# Altium project DronePCB.PrjPcb
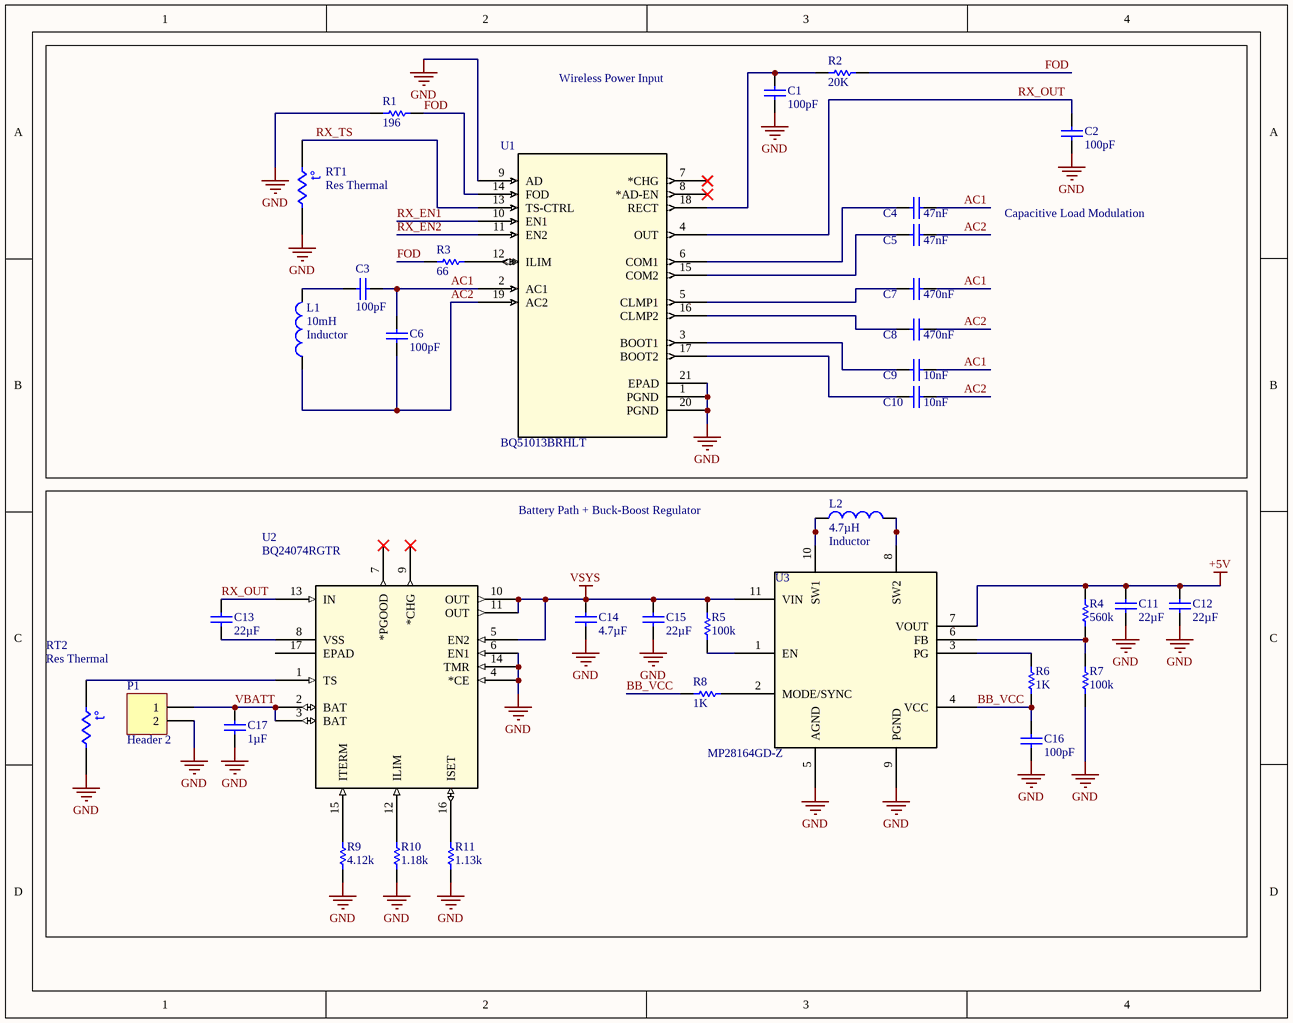
[diagram p0: DronePCB_1.SchDoc]
2 sheets, 58 parts. Net scope: global (net labels, ports and power ports of the same name join across sheets).
Sheets:
  DronePCB_1.SchDoc
  DronePCB_2.SchDoc

## Sheet DronePCB_1.SchDoc
size A; SheetNumber: 1; SheetTotal: 2

### Parts
C1  value 100pF  [RAD-0.3]  (hidden comment: Cap)
C2  value 100pF  [RAD-0.3]  (hidden comment: Cap)
C3  value 100pF  [RAD-0.3]  (hidden comment: Cap)
C4  value 47nF  [RAD-0.3]  (hidden comment: Cap)
C5  value 47nF  [RAD-0.3]  (hidden comment: Cap)
C6  value 100pF  [RAD-0.3]  (hidden comment: Cap)
C7  value 470nF  [RAD-0.3]  (hidden comment: Cap)
C8  value 470nF  [RAD-0.3]  (hidden comment: Cap)
C9  value 10nF  [RAD-0.3]  (hidden comment: Cap)
C10  value 10nF  [RAD-0.3]  (hidden comment: Cap)
C11  value 22µF  [RAD-0.3]  (hidden comment: Cap)
C12  value 22µF  [RAD-0.3]  (hidden comment: Cap)
C13  value 22µF  [RAD-0.3]  (hidden comment: Cap)
C14  value 4.7µF  [RAD-0.3]  (hidden comment: Cap)
C15  value 22µF  [RAD-0.3]  (hidden comment: Cap)
C16  value 100pF  [RAD-0.3]  (hidden comment: Cap)
C17  value 1µF  [RAD-0.3]  (hidden comment: Cap)
L1  Inductor  value 10mH  [0402-A]
L2  Inductor  value 4.7µH  [0402-A]
P1  Header 2  [CUI_TB002-500-02BE]
R1  value 196  [AXIAL-0.3]  (hidden comment: Res1)
R2  value 20K  [AXIAL-0.3]  (hidden comment: Res1)
R3  value 66  [AXIAL-0.3]  (hidden comment: Res1)
R4  value 560k  [AXIAL-0.3]  (hidden comment: Res1)
R5  value 100k  [AXIAL-0.3]  (hidden comment: Res1)
R6  value 1K  [AXIAL-0.3]  (hidden comment: Res1)
R7  value 100k  [AXIAL-0.3]  (hidden comment: Res1)
R8  value 1K  [AXIAL-0.3]  (hidden comment: Res1)
R9  value 4.12k  [AXIAL-0.3]  (hidden comment: Res1)
R10  value 1.18k  [AXIAL-0.3]  (hidden comment: Res1)
R11  value 1.13k  [AXIAL-0.3]  (hidden comment: Res1)
RT1  Res Thermal  [6-0805_N]
RT2  Res Thermal  [6-0805_N]
U1  BQ51013BRHLT  [RHL20_2P05X3P05]
U2  BQ24074RGTR  [RGT16_1P7X1P7]
U3  MP28164GD-Z  [QFN-11_MP28164_MNP]

### Blocks framed on the sheet
Battery Path + Buck-Boost Regulator: C11-C17 L2 P1 R4-R11 RT2 U2 U3

### Nets
+5V: C11.2 C12.2 R4.2 U3.7(VOUT)
GND: C1.2 C2.2 C11.1 C12.1 C14.1 C15.1 C16.1 C17.1 P1.2 R1.1 R7.1 R9.1 R10.1 R11.1 RT1.2 RT2.2 U1.1(PGND) U1.9(AD) U1.20(PGND) U1.21(EPAD) U2.4(*CE) U2.6(EN1) U2.14(TMR) U3.5(AGND) U3.9(PGND)
VBATT: C17.2 P1.1 U2.2(BAT) U2.3(BAT)
VSYS: C14.2 C15.2 R5.1 U2.5(EN2) U2.10(OUT) U2.11(OUT) U3.11(VIN)
AC1: C3.2 C4.2 C6.2 C7.2 C9.2 U1.2(AC1)
AC2: C5.2 C6.1 C8.2 C10.2 L1.1 U1.19(AC2)
BB_VCC: C16.2 R6.1 R8.2 U3.4(VCC)
FOD: R1.2 R2.2 R3.1 U1.14(FOD)
RX_EN1: U1.10(EN1)
RX_EN2: U1.11(EN2)
RX_OUT: C2.1 C13.2 U1.4(OUT) U2.13(IN)
RX_TS: RT1.1 U1.13(TS-CTRL)
NetC1_1: C1.1 R2.1 U1.18(RECT)
NetC3_1: C3.1 L1.2
NetC4_1: C4.1 U1.6(COM1)
NetC5_1: C5.1 U1.15(COM2)
NetC7_1: C7.1 U1.5(CLMP1)
NetC8_1: C8.1 U1.16(CLMP2)
NetC9_1: C9.1 U1.3(BOOT1)
NetC10_1: C10.1 U1.17(BOOT2)
NetC13_1: C13.1 U2.8(VSS)
NetL2_1: L2.1 U3.10(SW1)
NetL2_2: L2.2 U3.8(SW2)
NetR3_2: R3.2 U1.12(ILIM)
NetR4_1: R4.1 R7.2 U3.6(FB)
NetR5_2: R5.2 U3.1(EN)
NetR6_2: R6.2 U3.3(PG)
NetR8_1: R8.1 U3.2(MODE/SYNC)
NetR9_2: R9.2 U2.15(ITERM)
NetR10_2: R10.2 U2.12(ILIM)
NetR11_2: R11.2 U2.16(ISET)
NetRT2_1: RT2.1 U2.1(TS)

Not connected (* = marked no-connect by the designer): U1 7(*CHG)* 8(*AD-EN)*; U2 7(*PGOOD)* 9(*CHG)* 17(EPAD)

### Notes on the sheet
- Wireless Power Input
- Capacitive Load Modulation
- (in symbol Res Thermal) t°

### Library data of the parts
C1-C17 = Cap: Capacitor; Published: 8-Jun-2000; LatestRevisionDate: 17-Jul-2002; LatestRevisionNote: Re-released for DXP Platform.; PackageReference: RAD-0.3; Publisher: Altium Limited; PackageDescription: Radial Cap, Thru-Hole; 2 Leads; 0.3 in Pin Spacing
L1 L2 = Inductor: Code_IEC: 1005; Published: 8-Jun-2000; LatestRevisionDate: 29-May-2009; LatestRevisionNote: IPC-7351 Footprint Added.; PackageReference: 0402-A; Publisher: Altium Limited; PackageDescription: Chip Inductor; Code_JEITA: 0402
P1 = Header 2: Header, 2-Pin; LatestRevisionDate: 17-Jul-2002; LatestRevisionNote: Re-released for DXP Platform.; Publisher: Altium Limited
R1-R11 = Res1: Resistor; Published: 8-Jun-2000; LatestRevisionDate: 17-Jul-2002; LatestRevisionNote: Re-released for DXP Platform.; PackageReference: AXIAL-0.3; Publisher: Altium Limited; PackageDescription: Axial Device, Thru-Hole; 2 Leads; 0.3 in Pin Spacing
RT1 RT2 = Res Thermal: Thermistor; Published: 24-Mar-1999; LatestRevisionDate: 29-May-2009; LatestRevisionNote: IPC-7351 Footprint Added.; PackageVersion: Mar-2003; PackageReference: 6-0805; Publisher: Altium Limited; PackageDescription: Chip Resistor 0805 Case Size; Code_IPC: RESC2012
U1 = BQ51013BRHLT: WPC 1.1 Compatible Fully integrated Wireless power Receiver IC 20-VQFN 0 to 125; Manufacturer_Name: Texas Instruments; Copyright: Copyright (C) 2026 Ultra Librarian. All rights reserved.; Manufacturer_Part_Number: BQ51013BRHLT; RefDes: RefDes; Type: Type
U2 = BQ24074RGTR: Standalone 1-cell 1.5-A linear battery charger, Power Path, 4.2-V VBAT, 10.5-V OVP and 4.4-V VOUT 16-VQFN -40 to 85; Manufacturer_Name: Texas Instruments; Copyright: Copyright (C) 2026 Ultra Librarian. All rights reserved.; Manufacturer_Part_Number: BQ24074RGTR; RefDes: RefDes; Type: Type
U3 = MP28164GD-Z: High-Efficiency Single-Inductor Buck-Boost Converter with 4.2A Switches; Manufacturer_Name: Monolithic Power Systems; Copyright: Copyright (C) 2025 Ultra Librarian. All rights reserved.; Manufacturer_Part_Number: MP28164GD-Z; RefDes: RefDes; Type: Type

## Sheet DronePCB_2.SchDoc
size A; SheetNumber: 2; SheetTotal: 2; SPICEModelCacheAHKOHMFY: <root> / <DocumentId>AHKOHMFY</DocumentId> / <CacheFrame Number="0"> / <Model Name="irf1010" Kind="CKT"> / <Text>*IRF1010 MCE 4-2-96 / *55V  75A .014 ohm HEXFET pkg:TO-220 2,1,3 / .SUBCKT IRF1010  10 20 40 40 / M1   1  2  3  3  DMOS L=1U W=1U / RD  10  1  5.65M / RS  30  3  1.35M / RG  20  2  12.1 / CGS  2  3  2.15N / EGD 12  0  2  1  1 / VFB 14  0  0 / FFB  2  1  VFB  1 / CGD 13 14  4.49N / R1  13  0  1 / D1  12 13  DLIM / DDG 15 14  DCGD / R2  12 15  1 / D2  15  0  DLIM / DSD  3 10  DSUB / LS  30 40  7.5N / .MODEL DMOS NMOS (LEVEL=3 THETA=60M VMAX=114K ETA=2M VTO=3 KP=19.4) / .MODEL DCGD D (CJO=4.49N VJ=.6 M=.68) / .MODEL DSUB D (IS=311N N=1.5 RS=8.67M BV=55 CJO=4.08N VJ=.8 M=.42 TT=100N) / .MODEL DLIM D (IS=100U) / .ENDS IRF1010</Text> / </Model> / <Model Name="skydiode" Kind="MDL"> / <Text>*Default Schottky Diode / *Schottky Diode Pinout: A,K / .MODEL SKYDIODE D(EG=0.69 XTI=2)</Text> / </Model> / </CacheFrame> / </root>
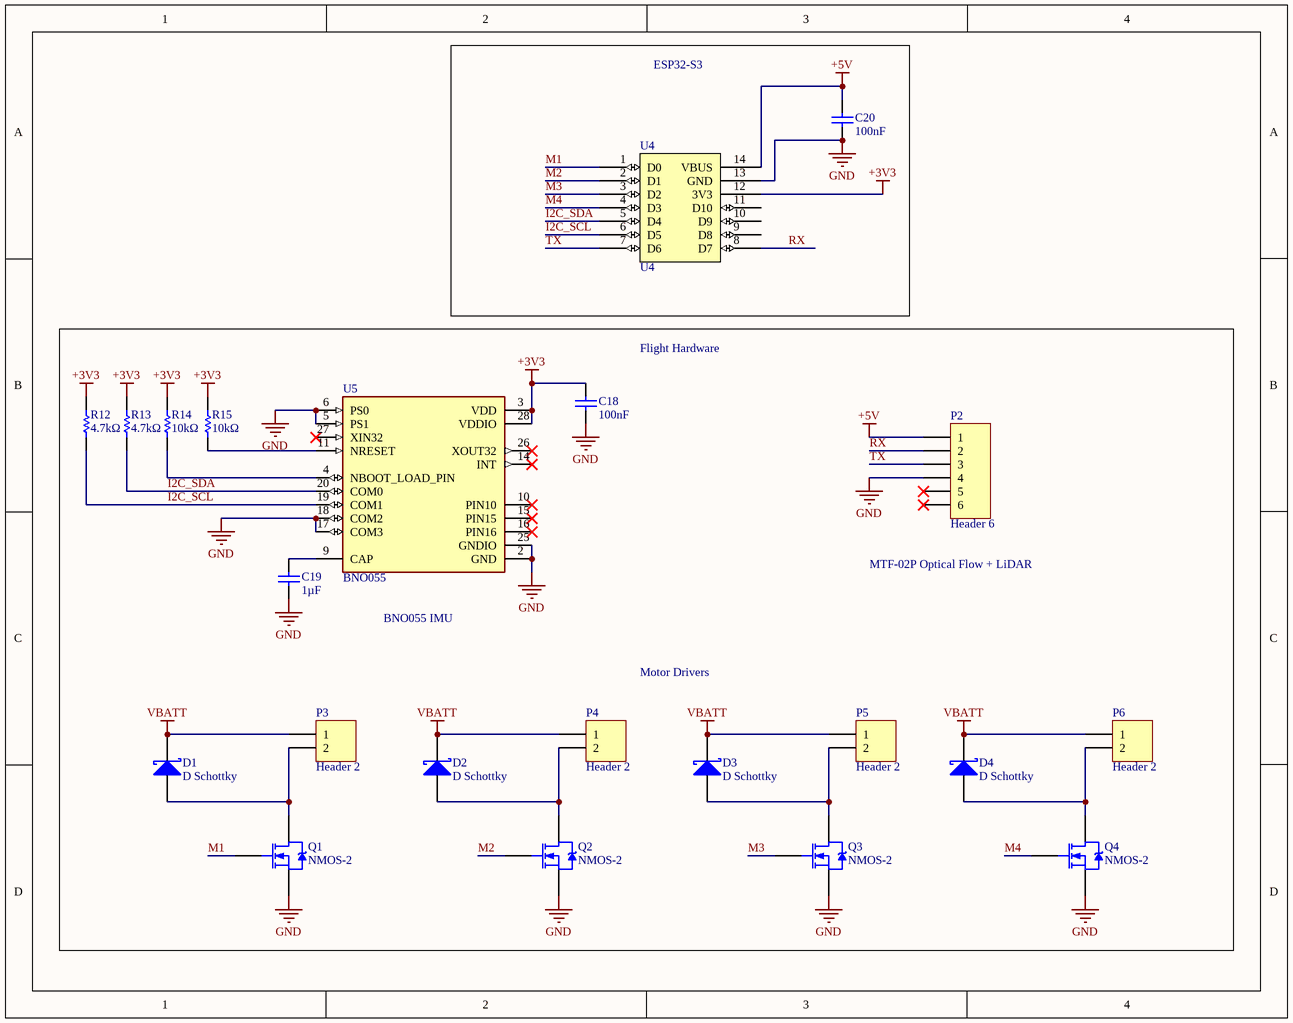
[diagram p1: DronePCB_2.SchDoc]

### Parts
C18  value 100nF  [RAD-0.3]  (hidden comment: Cap)
C19  value 1µF  [RAD-0.3]  (hidden comment: Cap)
C20  value 100nF  [RAD-0.3]  (hidden comment: Cap)
D1  D Schottky  [SMB]
D2  D Schottky  [SMB]
D3  D Schottky  [SMB]
D4  D Schottky  [SMB]
P2  Header 6  [HDR1X6]
P3  Header 2  [HDR1X2]
P4  Header 2  [HDR1X2]
P5  Header 2  [HDR1X2]
P6  Header 2  [HDR1X2]
Q1  NMOS-2  [TO-220AB]
Q2  NMOS-2  [TO-220AB]
Q3  NMOS-2  [TO-220AB]
Q4  NMOS-2  [TO-220AB]
R12  value 4.7kΩ  [AXIAL-0.3]  (hidden comment: Res1)
R13  value 4.7kΩ  [AXIAL-0.3]  (hidden comment: Res1)
R14  value 10kΩ  [AXIAL-0.3]  (hidden comment: Res1)
R15  value 10kΩ  [AXIAL-0.3]  (hidden comment: Res1)
U4  U4
U5  BNO055  [LGA28R50P4X10_380X520X100]

### Blocks framed on the sheet
ESP32-S3: C20 U4

### Nets
+3V3: C18.2 R12.2 R13.2 R14.1 R15.1 U4.12(3V3) U5.3(VDD) U5.28(VDDIO)
+5V: C20.2 P2.1 U4.14(VBUS)
GND: C18.1 C19.1 C20.1 P2.4 Q1.3(S) Q2.3(S) Q3.3(S) Q4.3(S) U4.13(GND) U5.2(GND) U5.5(PS1) U5.6(PS0) U5.17(COM3) U5.18(COM2) U5.25(GNDIO)
VBATT: D1.2(K) D2.2(K) D3.2(K) D4.2(K) P3.1 P4.1 P5.1 P6.1
I2C_SCL: R12.1 U4.6(D5) U5.19(COM1)
I2C_SDA: R13.1 U4.5(D4) U5.20(COM0)
M1: Q1.1(G) U4.1(D0)
M2: Q2.1(G) U4.2(D1)
M3: Q3.1(G) U4.3(D2)
M4: Q4.1(G) U4.4(D3)
RX: P2.2 U4.8(D7)
TX: P2.3 U4.7(D6)
NetC19_2: C19.2 U5.9(CAP)
NetD1_1: D1.1(A) P3.2 Q1.2(D)
NetD2_1: D2.1(A) P4.2 Q2.2(D)
NetD3_1: D3.1(A) P5.2 Q3.2(D)
NetD4_1: D4.1(A) P6.2 Q4.2(D)
NetR14_2: R14.2 U5.4(NBOOT_LOAD_PIN)
NetR15_2: R15.2 U5.11(NRESET)

Not connected (* = marked no-connect by the designer): P2 5* 6*; U4 9(D8) 10(D9) 11(D10); U5 10(PIN10)* 14(INT)* 15(PIN15)* 16(PIN16)* 26(XOUT32)* 27(XIN32)*

### Notes on the sheet
- Flight Hardware
- MTF-02P Optical Flow + LiDAR
- BNO055 IMU
- Motor Drivers

### Library data of the parts
C18-C20 = Cap: Capacitor; Published: 8-Jun-2000; LatestRevisionDate: 17-Jul-2002; LatestRevisionNote: Re-released for DXP Platform.; PackageReference: RAD-0.3; Publisher: Altium Limited; PackageDescription: Radial Cap, Thru-Hole; 2 Leads; 0.3 in Pin Spacing
D1-D4 = D Schottky: Schottky Diode; Published: 8-Jun-2000; LatestRevisionDate: 17-Jul-2002; LatestRevisionNote: Re-released for DXP Platform.; PackageReference: SMB; Publisher: Altium Limited; PackageDescription: DO-214-AA/SMB; 2 C-Bend Leads; Body 5.3 x 3.6 mm, inc. leads (LxW); Code_JEDEC: DO-214-AA
P2 = Header 6: Header, 6-Pin; LatestRevisionDate: 17-Jul-2002; LatestRevisionNote: Re-released for DXP Platform.; Publisher: Altium Limited
P3-P6 = Header 2: Header, 2-Pin; LatestRevisionDate: 17-Jul-2002; LatestRevisionNote: Re-released for DXP Platform.; Publisher: Altium Limited
Q1-Q4 = NMOS-2: N-Channel Power MOSFET; Note: Pin 2 is electrically connected to pin 4.; Published: 8-Jun-2000; LatestRevisionDate: 17-Jul-2002; LatestRevisionNote: Re-released for DXP Platform.; DatasheetVersion: PD-9.814; PackageVersion: Feb-1997; PackageReference: TO-220AB; Publisher: Altium Limited; PackageDescription: TO, Thru-Hole, Vertical, Heatsink Mounted; 3 In-Line Leads; Pitch 2.54 mm; ComponentLink1Description: Manufacturer Link; ComponentLink1URL: http://www.irf.com/
R12-R15 = Res1: Resistor; Published: 8-Jun-2000; LatestRevisionDate: 17-Jul-2002; LatestRevisionNote: Re-released for DXP Platform.; PackageReference: AXIAL-0.3; Publisher: Altium Limited; PackageDescription: Axial Device, Thru-Hole; 2 Leads; 0.3 in Pin Spacing
U4 = ESP32S3
U5 = BNO055: BNO055 9-axis Absolute Orientation Sensor ( SiP ) w/Sensors and Sensor Fusion; Package: None; Price: None; Value: *; MP: BNO055; Availability: Unavailable

## Nets that join several sheets
+5V: DronePCB_1 (C11.2 C12.2 R4.2 U3.7), DronePCB_2 (C20.2 P2.1 U4.14)
GND: DronePCB_1 (25 pins), DronePCB_2 (15 pins)
VBATT: DronePCB_1 (C17.2 P1.1 U2.2 U2.3), DronePCB_2 (8 pins)